# EAGLE design Main_Board (EAGLE 6.0)
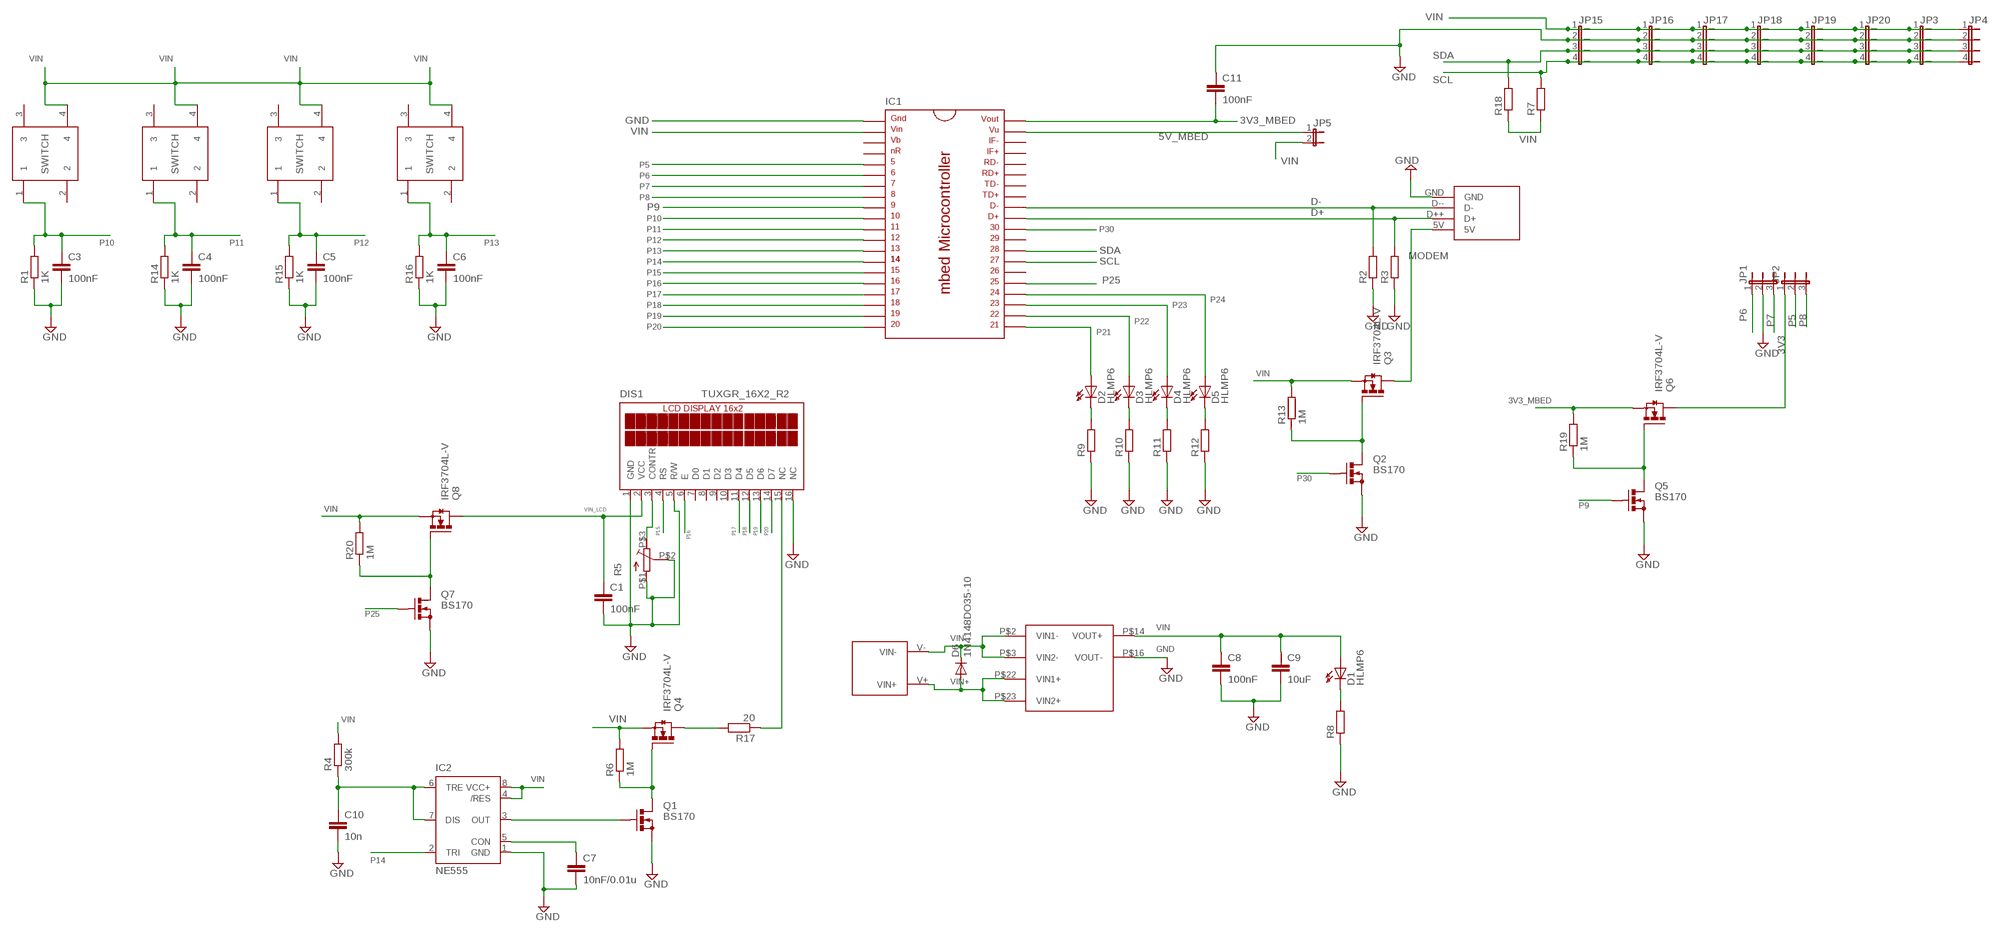
[diagram p0: schematic, sheet 1]

## Parts
C1  100nF  C5/3.5  [C5B3.5]
C3  100nF  C5/3.5  [C5B3.5]
C4  100nF  C5/3.5  [C5B3.5]
C5  100nF  C5/3.5  [C5B3.5]
C6  100nF  C5/3.5  [C5B3.5]
C7  10nF/0.01u  C5/3.5  [C5B3.5]
C8  100nF  C5/3.5  [C5B3.5]
C9  10uF  C5/3.5  [C5B3.5]
C10  10n  C5/3.5  [C5B3.5]
C11  100nF  C5/3.5  [C5B3.5]
D1  HLMP6  [HLMP6]
D2  HLMP6  [HLMP6]
D3  HLMP6  [HLMP6]
D4  HLMP6  [HLMP6]
D5  HLMP6  [HLMP6]
D6  1N4148DO35-10  [DO35-10]
DIS1  TUXGR_16X2_R2  [TUXGR_16X2_R2]
IC1  MBED_MICROCONTROLLER  [DIL40_0.9]
IC2  NE555  [DIL-08]
JP1  JP2W  [JP2W]
JP2  JP2W  [JP2W]
JP3  JP4E  [JP4]
JP4  JP4E  [JP4]
JP5  JP1E  [JP1]
JP15  JP4E  [JP4]
JP16  JP4E  [JP4]
JP17  JP4E  [JP4]
JP18  JP4E  [JP4]
JP19  JP4E  [JP4]
JP20  JP4E  [JP4]
Q1  BS170  [SOT54E]
Q2  BS170  [SOT54E]
Q3  IRF3704L-V  [TO262-V]
Q4  IRF3704L-V  [TO262-V]
Q5  BS170  [SOT54E]
Q6  IRF3704L-V  [TO262-V]
Q7  BS170  [SOT54E]
Q8  IRF3704L-V  [TO262-V]
R1  1K  R-EU_0411/12  [0411/12]
R2  R-EU_0411/12  [0411/12]
R3  R-EU_0411/12  [0411/12]
R4  300k  R-EU_0411/12  [0411/12]
R5  R-TRIMM  [IRG2014TRIM]
R6  1M  R-EU_0411/12  [0411/12]
R7  R-EU_0411/12  [0411/12]
R8  R-EU_0411/12  [0411/12]
R9  R-EU_0411/12  [0411/12]
R10  R-EU_0411/12  [0411/12]
R11  R-EU_0411/12  [0411/12]
R12  R-EU_0411/12  [0411/12]
R13  1M  R-EU_0411/12  [0411/12]
R14  1K  R-EU_0411/12  [0411/12]
R15  1K  R-EU_0411/12  [0411/12]
R16  1K  R-EU_0411/12  [0411/12]
R17  20  R-EU_0411/12  [0411/12]
R18  R-EU_0411/12  [0411/12]
R19  1M  R-EU_0411/12  [0411/12]
R20  1M  R-EU_0411/12  [0411/12]
U$1  USBA_SOCKET  [USBA_SOCKET]
U$4  INPUT_VOLTAGE_CONNECTOR  [INPUT_VOLTAGE_CONNECTOR]
U$5  TACT_SWITCH  [TACT_SWITCH]
U$6  TACT_SWITCH  [TACT_SWITCH]
U$7  TACT_SWITCH  [TACT_SWITCH]
U$8  TACT_SWITCH  [TACT_SWITCH]
U$9  TRACO_ISOLATED_SUPPLY  [TRACO_ISOLATED_SUPPLY]

## Nets
3V3: JP2.1 Q6.2(D)
3V3_MBED: C11.2 IC1.40 Q6.3(S) R19.2
5V_MBED: IC1.39 JP5.1
D+: IC1.31 R3.2 U$1.D++(D+)
D-: IC1.32 R2.2 U$1.D--(D-)
GND: C1.2 C3.2 C4.2 C5.2 C6.2 C7.2 C8.2 C9.2 C10.2 C11.1 DIS1.1(GND) DIS1.5(R/W) DIS1.16(NC) IC1.1 IC2.1(GND) JP1.2 JP3.2 JP4.2 JP15.2 JP16.2 JP17.2 JP18.2 JP19.2 JP20.2 Q1.S Q2.S Q5.S Q7.S R1.1 R2.1 R3.1 R5.P$1(A) R5.P$2(S) R8.1 R9.1 R10.1 R11.1 R12.1 R14.1 R15.1 R16.1 U$1.GND U$9.P$16(VOUT-)
MODEM: Q3.2(D) U$1.5V
N$1: D1.K R8.2
N$2: C7.1 IC2.5(CON)
N$3: DIS1.3(CONTR) R5.P$3(E)
N$4: D2.K R9.2
N$5: Q2.D Q3.1(G) R13.1
N$6: C10.1 IC2.6(TRE) IC2.7(DIS) R4.1
N$7: Q5.D Q6.1(G) R19.1
N$8: Q1.D Q4.1(G) R6.1
N$9: DIS1.15(NC) R17.1
N$10: Q7.D Q8.1(G) R20.1
N$11: IC2.3(OUT) Q1.G
N$12: Q4.2(D) R17.2
N$15: D3.K R10.2
N$16: D4.K R11.2
N$17: D5.K R12.2
P5: IC1.5 JP2.2
P6: IC1.6 JP1.1
P7: IC1.7 JP1.3
P8: IC1.8 JP2.3
P9: IC1.9 Q5.G
P10: C3.1 IC1.10 R1.2 U$5.1
P11: C4.1 IC1.11 R14.2 U$6.1
P12: C5.1 IC1.12 R15.2 U$7.1
P13: C6.1 IC1.13 R16.2 U$8.1
P14: IC1.14 IC2.2(TRI)
P15: DIS1.4(RS) IC1.15
P16: DIS1.6(E) IC1.16
P17: DIS1.11(D4) IC1.17
P18: DIS1.12(D5) IC1.18
P19: DIS1.13(D6) IC1.19
P20: DIS1.14(D7) IC1.20
P21: D2.A IC1.21
P22: D3.A IC1.22
P23: D4.A IC1.23
P24: D5.A IC1.24
P25: IC1.25 Q7.G
P30: IC1.30 Q2.G
SCL: IC1.27 JP3.4 JP4.4 JP15.4 JP16.4 JP17.4 JP18.4 JP19.4 JP20.4 R7.2
SDA: IC1.28 JP3.3 JP4.3 JP15.3 JP16.3 JP17.3 JP18.3 JP19.3 JP20.3 R18.2
VIN: C8.1 C9.1 D1.A IC1.2 IC2.4(/RES) IC2.8(VCC+) JP3.1 JP4.1 JP5.2 JP15.1 JP16.1 JP17.1 JP18.1 JP19.1 JP20.1 Q3.3(S) Q4.3(S) Q8.3(S) R4.2 R6.2 R7.1 R13.2 R18.1 R20.2 U$5.4 U$6.4 U$7.4 U$8.4 U$9.P$14(VOUT+)
VIN+: D6.A U$4.V+(VIN+) U$9.P$22(VIN1+) U$9.P$23(VIN2+)
VIN-: D6.C U$4.V-(VIN-) U$9.P$2(VIN1-) U$9.P$3(VIN2-)
VIN_LCD: C1.1 DIS1.2(VCC) Q8.2(D)
Unconnected: DIS1.7(D0) DIS1.8(D1) DIS1.9(D2) DIS1.10(D3) IC1.3 IC1.4 IC1.26 IC1.29 IC1.33 IC1.34 IC1.35 IC1.36 IC1.37 IC1.38 U$5.2 U$5.3 U$6.2 U$6.3 U$7.2 U$7.3 U$8.2 U$8.3

## Library data of the parts
C1 C3-C11 = capacitor-wima:C: CAPACITOR naming: grid - package width
D1-D5 = display-hp:HLMP6: LED 2mm horizontal; MF: AGILENT TECHNOLOGIES; MPN: HLMP-6500; OC_FARNELL: 1652490; OC_NEWARK: 40K0088
D6 = diode:1N4148: DIODE high speed (Philips)
DIS1 = display-lcd3:TUXGR_16X2_R2: Tuxgraphics LCD display 16x2 characters reflective, without background light Source: tuxgr_12x2_r2.pdf; OC_FARNELL: unknown; OC_NEWARK: unknown
IC1 = mbed-microcontroller:MBED_MICROCONTROLLER: mbed Microcontroller, DIP40, 0.9"
IC2 = st-microelectronics:NE555: General purpose bipolar Timer; MF: Arrow Electronics; MPN: NE555N; OC_FARNELL: 1467742; OC_NEWARK: 89K1486
JP1 JP2 = jumper:JP2W: JUMPER
JP3 JP4 JP15-JP20 = jumper:JP4E: JUMPER
JP5 = jumper:JP1E: JUMPER
Q1 Q2 Q5 Q7 = transistor-small-signal:BS170: N-CHANNEL MOS FET
Q3 Q4 Q6 Q8 = transistor-power:IRF3704: SMPS MOSFET HEXFET® Power MOSFET Source: http://www.irf.com/product-info/datasheets/data/irf3704.pdf
R1-R4 R6-R20 = rcl:R-EU_: RESISTOR, European symbol
R5 = rcl:R-TRIMM: Trimm resistor
U$1 = ekohub2013:USBA_SOCKET
U$4 = ekohub2013:INPUT_VOLTAGE_CONNECTOR
U$5-U$8 = ekohub2013:TACT_SWITCH
U$9 = ekohub2013:TRACO_ISOLATED_SUPPLY

## Board
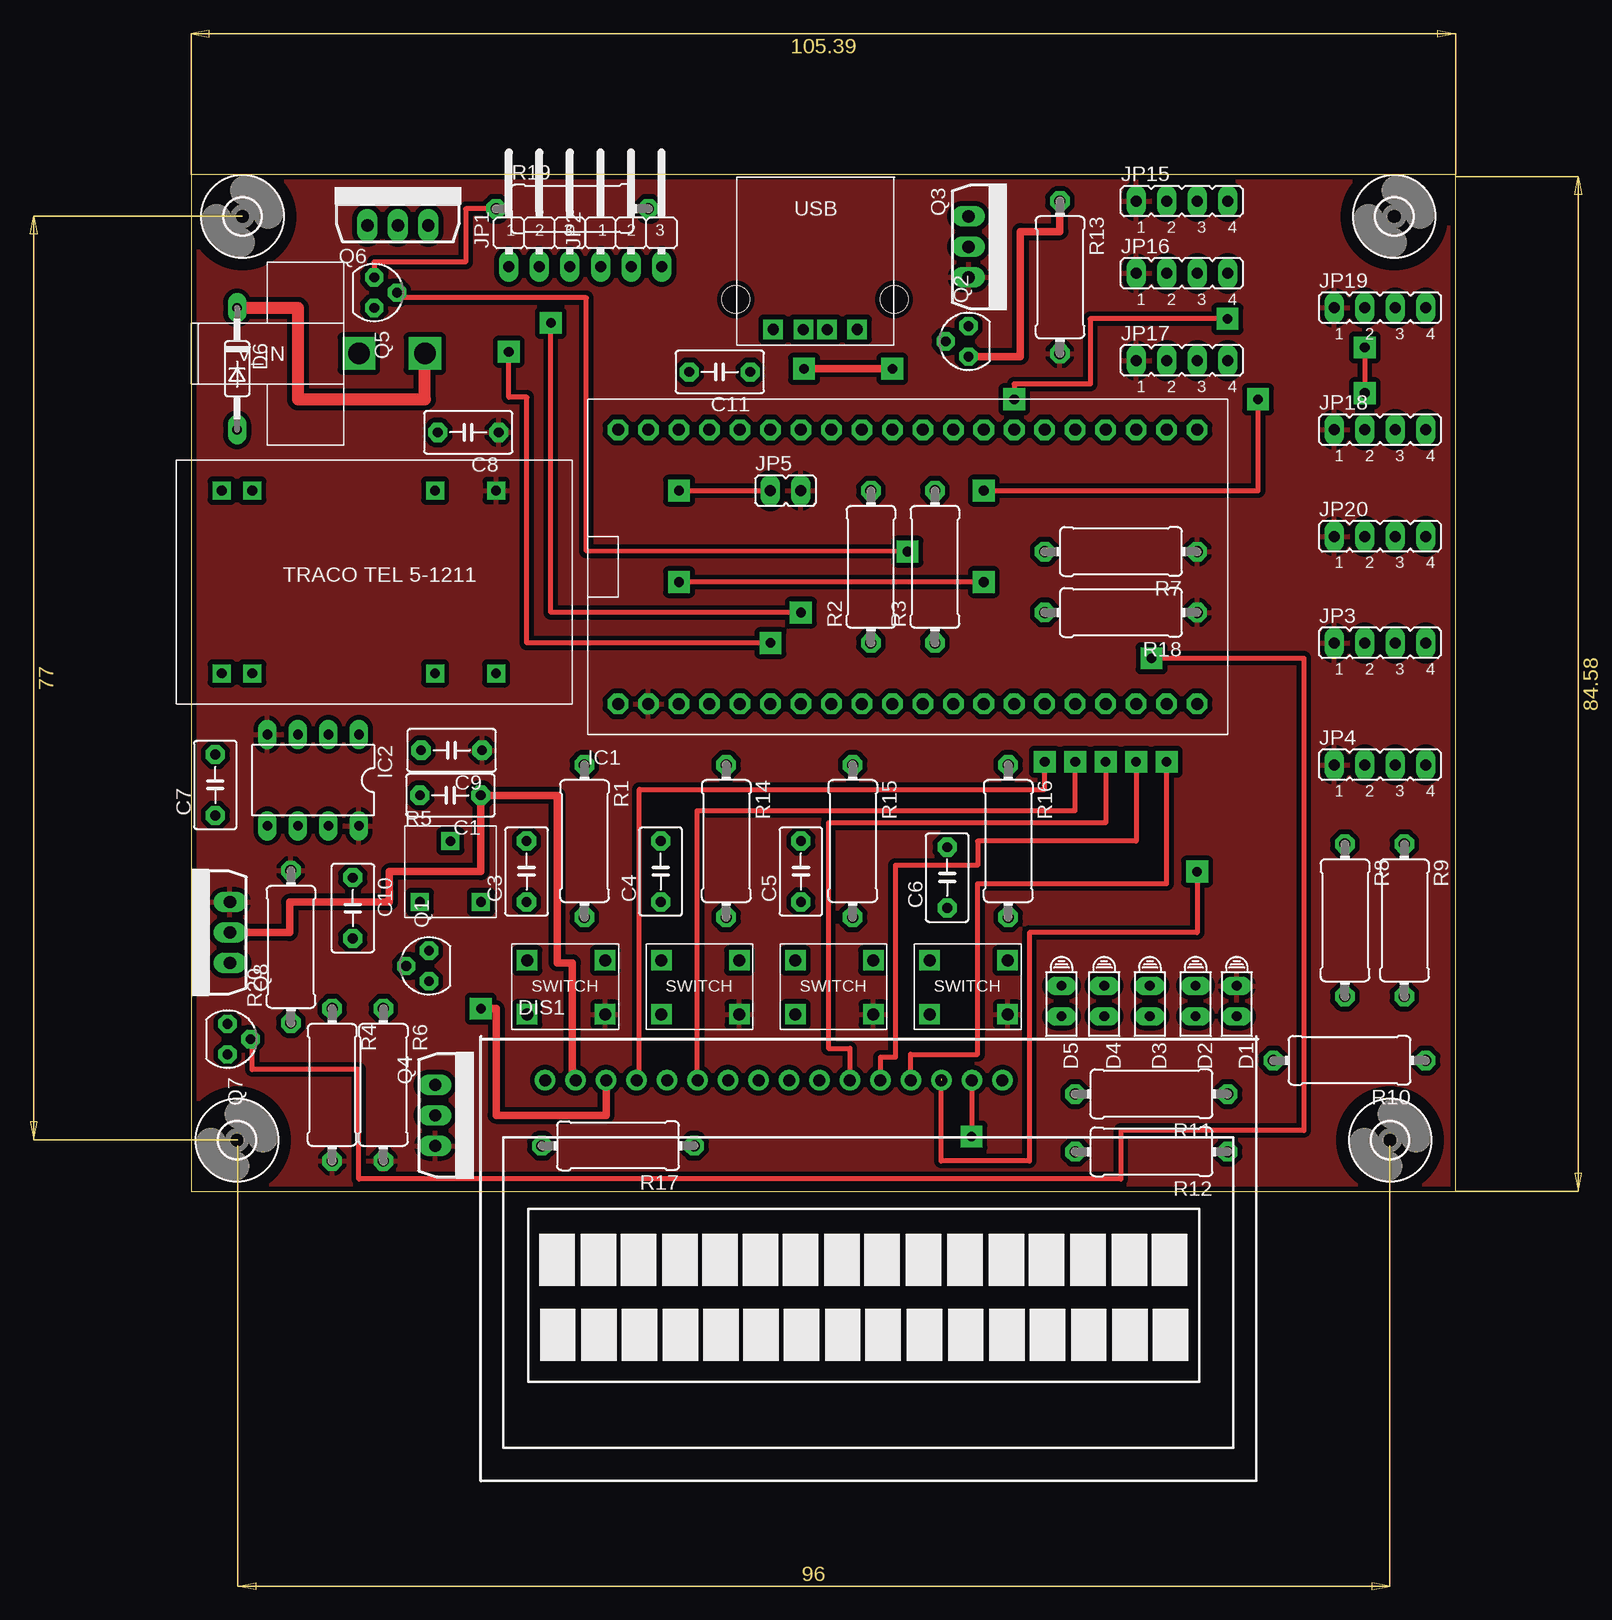
[diagram p1: board, top side]
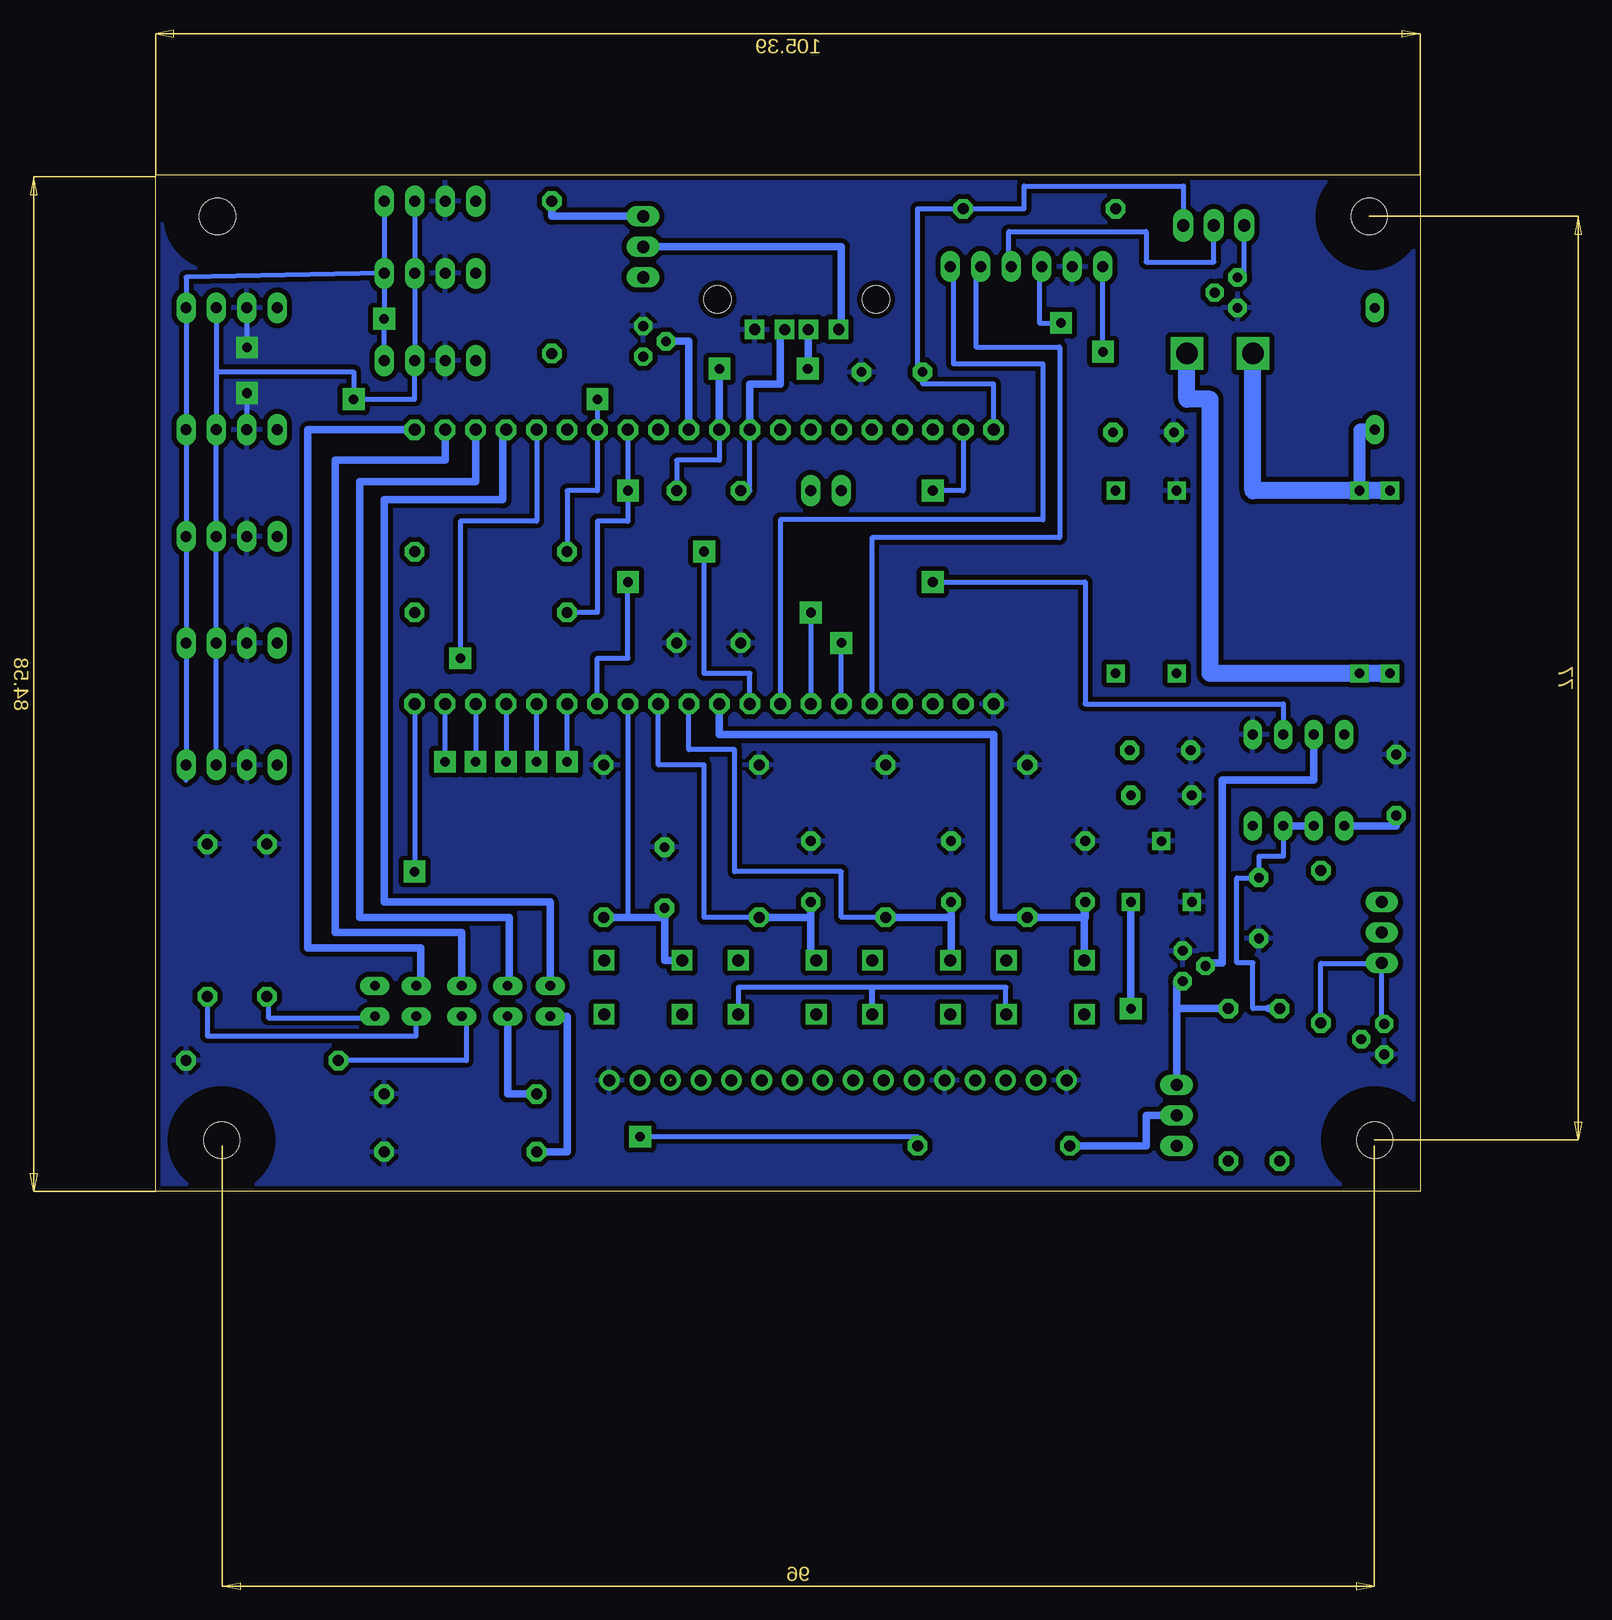
[diagram p2: board, bottom side, seen from below]

Size 105.39 x 84.76 mm. Coordinates in mm from the lower left corner, seen from the top.
Outline: 0,0 105.39,0 105.39,84.76 0,84.76 0,0
Copper layers (1*16): Top 0.035mm / dielectric 1.5mm / Bottom 0.035mm
Design rules: minimum track width 16mil, minimum drill 0.7mm, track to track 13mil, track to pad 13mil, pad to pad 13mil, via to via 13mil, smd to smd 0mil, copper to edge 10mil, drill to drill 10mil, minimum pad ring 14mil, minimum via ring 20mil, stop-mask expansion 0mil, vias tented up to drill 0mil, thermal gap 15mil

### Footprints (pad centres in the part's own frame; a part is rotated, then mirrored left to right if it is on the bottom)
C5B3.5 = drill 0.813 pad 1.6 octagon: 1 -2.54,0; 2 2.54,0
HLMP6 = drill 0.813 long: A -1.27,0; K 1.27,0
DO35-10 = drill 0.813 long: A 5.08,0; C -5.08,0
TUXGR_16X2_R2 = drill 1 pad 1.676: 1 0.28,27.05; 2 2.82,27.05; 3 5.36,27.05; 4 7.9,27.05; 5 10.44,27.05; 6 12.98,27.05; 7 15.52,27.05; 8 18.06,27.05; 9 20.6,27.05; 10 23.14,27.05; 11 25.68,27.05; 12 28.22,27.05; 13 30.76,27.05; 14 33.3,27.05; 15 35.84,27.05; 16 38.38,27.05
DIL40_0.9 = drill 1 pad 1.397 octagon: 1 -22.86,-11.43; 2 -20.32,-11.43; 3 -17.78,-11.43; 4 -15.24,-11.43; 5 -12.7,-11.43; 6 -10.16,-11.43; 7 -7.62,-11.43; 8 -5.08,-11.43; 9 -2.54,-11.43; 10 0,-11.43; 11 2.54,-11.43; 12 5.08,-11.43; 13 7.62,-11.43; 14 10.16,-11.43; 15 12.7,-11.43; 16 15.24,-11.43; 17 17.78,-11.43; 18 20.32,-11.43; 19 22.86,-11.43; 20 25.4,-11.43; 21 25.4,11.43; 22 22.86,11.43; 23 20.32,11.43; 24 17.78,11.43; 25 15.24,11.43; 26 12.7,11.43; 27 10.16,11.43; 28 7.62,11.43; 29 5.08,11.43; 30 2.54,11.43; 31 0,11.43; 32 -2.54,11.43; 33 -5.08,11.43; 34 -7.62,11.43; 35 -10.16,11.43; 36 -12.7,11.43; 37 -15.24,11.43; 38 -17.78,11.43; 39 -20.32,11.43; 40 -22.86,11.43
DIL-08 = drill 0.813 long: 1 -3.81,-3.81; 2 -1.27,-3.81; 3 1.27,-3.81; 4 3.81,-3.81; 5 3.81,3.81; 6 1.27,3.81; 7 -1.27,3.81; 8 -3.81,3.81
JP2W = drill 0.914 long: 1 -2.54,-1.27; 2 0,-1.27; 3 2.54,-1.27
JP4 = drill 0.914 long: 1 -3.81,0; 2 -1.27,0; 3 1.27,0; 4 3.81,0
JP1 = drill 0.914 long: 1 0,-1.27; 2 0,1.27
SOT54E = drill 0.813 octagon: D -1.27,0; G 0,1.905; S 1.27,0
TO262-V = drill 1.016 long: 1 -2.54,0; 2 0,0; 3 2.54,0
0411/12 = drill 0.914 octagon: 1 -6.35,0; 2 6.35,0
IRG2014TRIM = drill 0.8 square: P$1 0,0; P$2 2.54,5.08; P$3 5.08,0
USBA_SOCKET = drill 0.92 square: 5V 4.85,0.53; GND -2.15,0.53 | drill 0.92 pad 1.016 square: D++ 2.335,0.531; D-- 0.355,0.531 | hole 2.3: -5.23,-1.97; 7.97,-1.97
INPUT_VOLTAGE_CONNECTOR = drill 1.8 square: V+ 0,0; V- 5.5,0
TACT_SWITCH = drill 1 square: 1 -3.5,2; 2 3,2; 3 -3.5,-2.5; 4 3,-2.5
TRACO_ISOLATED_SUPPLY = drill 0.8 square: P$1 22.86,0; P$2 0,0; P$3 2.54,0; P$4 17.78,0; P$14 22.86,15.24; P$16 17.78,15.24; P$22 2.54,15.24; P$23 0,15.24
3,0 = hole 3: 0,0

### Placement (x,y rotation side)
C1  21.59,33.02 180 top
C3  27.94,26.67 90 top
C4  39.12,26.67 90 top
C5  50.8,26.67 90 top
C6  62.99,26.16 90 top
C7  2.01,33.88 90 top
C8  23.08,63.28 180 top
C9  21.69,36.77 180 top
C10  13.46,23.62 270 top
C11  44.04,68.31 180 top
D1  87.12,15.88 270 top
D2  83.69,15.88 270 top
D3  79.88,15.88 270 top
D4  76.07,15.88 270 top
D5  72.52,15.88 270 top
D6  3.81,68.58 270 top
DIS1  29.21,-17.78 0 top
IC1  58.42,52.07 0 top
IC2  10.16,34.29 180 top
JP1  29.01,78.37 0 top
JP2  36.65,78.37 0 top
JP3  99.06,45.72 0 top
JP4  99.06,35.56 0 top
JP5  49.53,58.42 270 top
JP15  82.55,82.55 0 top
JP16  82.55,76.53 0 top
JP17  82.55,69.27 0 top
JP18  99.06,63.5 0 top
JP19  99.06,73.66 0 top
JP20  99.06,54.61 0 top
Q1  19.81,18.8 90 top
Q2  64.77,70.87 90 top
Q3  64.77,78.74 270 top
Q4  20.32,6.35 270 top
Q5  15.24,74.93 270 top
Q6  17.22,80.53 0 top
Q7  3.02,12.7 270 top
Q8  3.23,21.59 90 top
R1  32.77,29.21 270 top
R2  56.64,52.07 90 top
R3  61.98,52.07 90 top
R4  11.73,8.89 270 top
R5  19.05,24.13 0 top
R6  16,8.89 270 top
R7  77.47,53.34 180 top
R8  96.14,22.61 270 top
R9  101.09,22.61 270 top
R10  96.52,10.92 180 top
R11  80.01,8.13 180 top
R12  80.01,3.3 180 top
R13  72.39,76.2 270 top
R14  44.58,29.21 270 top
R15  55.12,29.21 270 top
R16  68.07,29.21 270 top
R17  35.56,3.81 180 top
R18  77.47,48.26 180 top
R19  31.75,81.92 0 top
R20  8.31,20.4 90 top
U$1  53.34,72.39 180 top
U$4  13.97,69.85 0 top
U$5  31.5,17.27 0 top
U$6  42.67,17.27 0 top
U$7  53.85,17.27 0 top
U$8  65.02,17.27 0 top
U$9  2.54,43.18 0 top
U$10  [3,0]  3.81,4.28 0 top
U$11  [3,0]  100.25,81.28 0 top
U$12  [3,0]  4.26,81.28 0 top
U$13  [3,0]  99.9,4.28 0 top

### Tracks (layer width: path | path; a pad name or v marks a point on that pad's centre or on a via)
3V3
  Bottom 0.406: JP2.1 34.29,77.1 34.29,80.01 22.86,80.01 22.86,77.47 17.22,77.47 Q6.2
3V3_MBED
  Bottom 0.406: IC1.40 35.56,67.31 41.46,67.31 41.46,68.4 41.5,68.4 | 41.5,68.4 C11.2 | 41.5,68.4 41.91,68.4 41.91,81.92 R19.2 33.02,81.92 33.02,83.82 19.76,83.82 Q6.3
5V_MBED  (via drill 0.8)
  Top 0.406: v40.64,58.42 JP5.1
  Bottom 0.406: IC1.39 38.1,58.42 v40.64,58.42
D+  (via drill 0.8)
  Top 0.61: v58.42,68.58 v51.05,68.58
  Bottom 0.406: IC1.31 58.42,60.96 61.98,60.96 R3.2
  Bottom 0.61: IC1.31 v58.42,68.58 | v51.05,68.58 51.01,68.58 U$1.D++
D-
  Bottom 0.406: R2.2 55.88,58.42 IC1.32
  Bottom 0.61: U$1.D-- 53.34,71.86 53.34,67.31 55.88,67.31 IC1.32
GND  (via drill 0.8)
  Top 0.406: v97.79,70.36 v97.79,66.55 | JP17.2 81.28,69.85
  Bottom 0.406: JP19.2 v97.79,70.36 | v97.79,66.55 JP18.2
  Bottom 0.61: Q2.S 64.77,72.39
  pour Bottom (isolate 0.406): 0,84.58 105.41,84.58 105.41,0 0,0
MODEM
  Bottom 0.61: U$1.5V 48.26,71.86 48.26,78.74 Q3.2
N$1
  Bottom 0.406: R8.2 96.01,16.26 96.01,14.48 86.87,14.48 | 86.87,14.73 D1.K
  Bottom 0.61: 86.87,14.48 D1.K
N$2
  Bottom 0.61: IC2.5 2.01,30.48 C7.1
N$3  (via drill 0.8)
  Top 0.61: v24.13,15.24 25.4,15.24 25.4,6.35 34.57,6.35 DIS1.3
  Bottom 0.61: R5.P$3 v24.13,15.24
N$4
  Bottom 0.406: R9.2 101.09,12.95 83.69,12.95 D2.K
  Bottom 0.61: D2.K 83.06,14.61
N$5
  Top 0.61: R13.1 72.39,80.01 69.09,80.01 69.09,69.6 Q2.D
  Bottom 0.61: Q3.1 72.39,81.28 R13.1
N$6
  Bottom 0.406: IC2.7 11.43,27.94 13.46,27.94 C10.1 13.46,26.14 15.29,26.14 15.29,19.05 13.97,19.05 13.97,15.24 12.7,15.24
  Bottom 0.61: IC2.6 IC2.7 | 12.7,15.24 R4.1
N$7
  Top 0.406: R19.1 22.86,81.92 22.86,77.47 15.24,77.47 Q5.D
  Bottom 0.406: Q5.D 14.68,76.2 Q6.1
N$8
  Bottom 0.61: 20.32,15.24 R6.1 | Q1.D 20.32,17.53 20.32,15.24 | 20.32,15.24 Q4.1
N$9  (via drill 0.8)
  Top 0.406: 65.02,9.27 v65.02,4.57
  Top 0.61: DIS1.15 65.02,9.27
  Bottom 0.406: v65.02,4.57 41.91,4.57 R17.1
N$10
  Bottom 0.406: Q7.D 3.23,13.97 Q8.1 3.23,19.02 8.31,19.02 R20.1
N$11
  Bottom 0.61: IC2.3 8.89,34.29 16.51,34.29 16.51,19.05 17.91,19.05 Q1.G
N$12
  Bottom 0.61: Q4.2 22.86,6.35 22.86,3.81 R17.2
N$15
  Bottom 0.406: D3.K 79.5,14.61 79.5,10.92 R10.2
N$16
  Bottom 0.61: R11.2 76.07,8.13 D4.K
N$17
  Bottom 0.61: D5.K 71.12,14.61 71.12,3.3 R12.2
P5
  Bottom 0.406: JP2.2 37.05,77.1 37.05,70.4 30.06,70.4 30.06,54.5 45.72,54.5 IC1.5
P6  (via drill 0.8)
  Top 0.406: v48.26,45.72 27.96,45.72 27.96,66.2 26.46,66.2 v26.46,70
  Bottom 0.406: IC1.6 v48.26,45.72 | v26.46,70 JP1.1
P7  (via drill 0.8)
  Top 0.406: v50.8,48.26 29.96,48.26 v29.96,72.4
  Bottom 0.406: JP1.3 31.75,76.2 31.75,72.39 v29.96,72.39 v29.96,72.4 | v50.8,48.26 IC1.7
P8
  Bottom 0.406: JP2.3 38.92,77.1 38.92,69 31.46,69 31.46,56 53.34,56 IC1.8
P9  (via drill 0.8)
  Top 0.406: v59.69,53.34 32.92,53.39 32.92,74.5 17.14,74.5 Q5.G
  Bottom 0.406: IC1.9 55.88,43.18 59.69,43.18 v59.69,53.34
P10
  Bottom 0.61: U$5.1 28,24.13 C3.1 27.94,22.86 R1.2 35.56,22.86 35.56,38.1 58.42,38.1 IC1.10
P11
  Bottom 0.406: R14.2 48.26,22.86 48.26,26.67 57.15,26.67 57.15,36.83 60.96,36.83 IC1.11
  Bottom 0.61: U$6.1 39.12,19.27 39.12,22.86 | 39.12,22.86 C4.1 39.37,24.13 | R14.2 39.12,22.86
P12
  Bottom 0.406: R15.2 59.69,22.86 59.69,35.56 63.5,35.56 IC1.12
  Bottom 0.61: U$7.1 50.8,19.27 50.8,22.86 | 50.8,22.86 C5.1 | R15.2 50.8,22.86
P13
  Bottom 0.406: IC1.13 66.04,22.86
  Bottom 0.61: U$8.1 62.99,19.27 62.99,22.86 | C6.1 62.99,22.86 | 62.99,22.86 66.04,22.86 R16.2
P14  (via drill 0.8)
  Top 0.406: v66.04,50.8 v40.64,50.8
  Bottom 0.406: v40.64,50.8 27.94,50.8 27.94,40.64 11.43,40.64 IC2.2 | IC1.14 68.58,44.45 66.04,44.45 v66.04,50.8
P15  (via drill 0.8)
  Top 0.406: DIS1.4 37.34,9.27 37.34,33.53 71.12,33.53 v71.12,35.81
  Bottom 0.406: v71.12,35.81 IC1.15
P16  (via drill 0.8)
  Top 0.406: DIS1.6 42.16,9.27 42.16,31.75 73.66,31.75 v73.66,35.81
  Bottom 0.406: v73.66,35.81 IC1.16
P17  (via drill 0.8)
  Top 0.406: v76.2,35.81 76.2,30.73 53.09,30.73 53.09,11.94 54.89,11.94 DIS1.11
  Bottom 0.406: IC1.17 v76.2,35.81
P18  (via drill 0.8)
  Top 0.406: v78.74,35.81 78.74,29.21 65.53,29.21 65.53,27.18 58.67,27.18 58.67,11.18 57.43,11.18 DIS1.12
  Bottom 0.406: IC1.18 v78.74,35.81
P19  (via drill 0.8)
  Top 0.406: DIS1.13 59.94,9.27 59.94,11.43 65.53,11.43 65.53,25.65 81.28,25.65 v81.28,35.81
  Bottom 0.406: v81.28,35.81 IC1.19
P20  (via drill 0.8)  (1 unrouted)
  Top 0.406: v83.82,26.67 83.82,21.59 69.85,21.59 69.85,2.54 62.48,2.54 62.48,9.4
  Top 0.61: DIS1.14 62.48,9.27
  Bottom 0.406: IC1.20 v83.82,26.67
P21
  Bottom 0.61: IC1.21 92.71,63.5 92.71,20.32 83.31,20.32 83.31,17.02 83.18,17.02 D2.A
P22
  Bottom 0.61: IC1.22 81.28,60.96 90.42,60.96 90.42,21.59 79.88,21.59 D3.A
P23
  Bottom 0.61: D4.A 75.95,17.14 75.95,22.86 88.39,22.86 88.39,59.18 78.74,59.18 IC1.23
P24
  Bottom 0.61: IC1.24 76.45,63.5 76.45,57.66 86.36,57.66 86.36,24.13 72.52,24.13 D5.A
P25  (via drill 0.8)
  Top 0.254: 5.08,12.7 Q7.G
  Top 0.406: v80.01,44.45 92.71,44.45 92.71,5.08 77.47,5.08 77.47,1.04 13.97,1.04 13.97,10.16 5.08,10.16 5.08,12.7
  Bottom 0.406: IC1.25 73.66,55.88 80.01,55.88 v80.01,44.45
P30
  Bottom 0.61: IC1.30 60.96,70.87 Q2.G
SCL  (via drill 0.8)
  Top 0.406: v86.36,72.75 74.9,72.75 74.93,67.31 68.58,67.31 v68.58,66.04
  Bottom 0.406: JP15.4 JP16.4 | JP16.4 v86.36,72.75 JP17.4 | 102.87,34.29 JP4.4 JP3.4 JP20.4 JP18.4 JP19.4 102.87,76.2 JP16.4 | v68.58,66.04 IC1.27 68.58,58.42 71.12,58.42 R7.2
SDA  (via drill 0.8)
  Top 0.406: v66.04,58.42 88.9,58.42 v88.9,66.04
  Bottom 0.406: JP15.3 JP16.3 JP17.3 83.82,66.04 v88.9,66.04 88.9,68.33 100.33,68.33 | JP4.3 JP3.3 JP20.3 JP18.3 100.33,68.33 | JP19.3 100.33,68.33 | R18.2 68.58,48.26 68.58,55.88 66.04,55.88 v66.04,58.42 IC1.28
VIN
  Bottom 0.406: U$5.4 34.54,14.77 34.54,17.02 45.67,17.02 U$6.4 45.72,14.77 45.72,17.02 56.85,17.02 U$7.4
  pour Top (isolate 0.406): 0,84.58 105.41,84.58 105.41,0 0,0
VIN+
  Bottom 1.016: D6.A 5.08,63.5 U$9.P$22
  Bottom 1.422: U$9.P$23 U$9.P$22 13.97,58.42 U$4.V+
VIN-
  Top 1.016: D6.C 8.89,73.66 8.89,66.04 19.47,66.04 U$4.V-
  Bottom 1.422: U$9.P$2 U$9.P$3 17.53,43.18 17.53,66.04 19.47,66.04 U$4.V-
VIN_LCD
  Top 0.61: DIS1.2 31.75,9.27 31.75,19.05 30.48,19.05 30.48,33.02 C1.1 24.13,26.67 16.51,26.67 16.51,24.13 8.2,24.13 8.2,21.59 Q8.2